# EAGLE schematic UNDP_Shield (EAGLE 9.6.2)
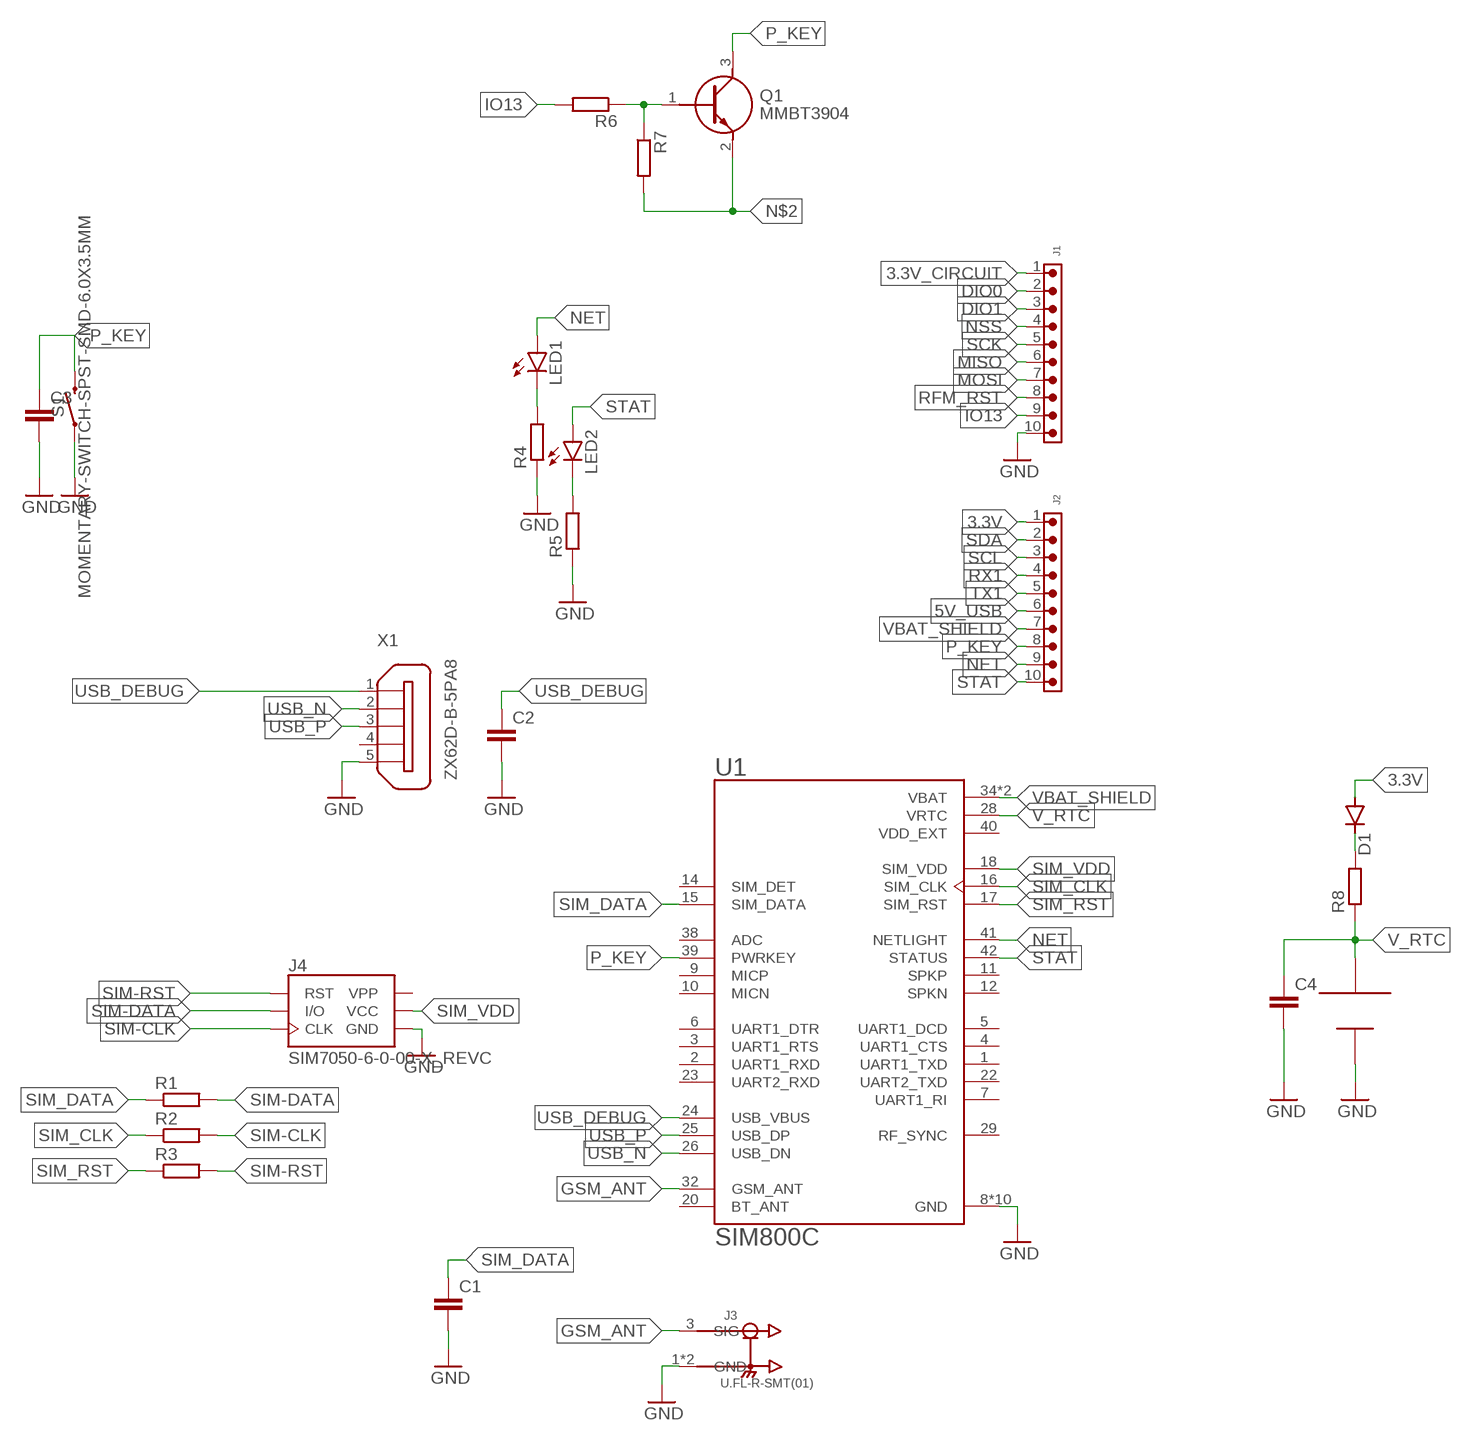
[diagram p0: schematic, sheet 1]

## Parts
C1  C-EUC0603  [C0603]
C2  C-EUC0603  [C0603]
C3  C-EUC0603  [C0603]
C4  C-EUC0603  [C0603]
D1  DIODE-DO214AC  [DO214AC]
J1  6200XX11121_62001011121  [62001011121]
J2  6200XX11121_62001011121  [62001011121]
J3  U.FL-R-SMT(01)  [HRS_U.FL-R-SMT(01)]
J4  SIM7050-6-0-00-X_REVC  [GCT_SIM7050-6-0-00-X_REVC]
LED1  LEDCHIP-LED0805  [CHIP-LED0805]
LED2  LEDCHIP-LED0805  [CHIP-LED0805]
Q1  MMBT3904  [SOT95P240X120-3N]
R1  R-EU_R0603  [R0603]
R2  R-EU_R0603  [R0603]
R3  R-EU_R0603  [R0603]
R4  R-EU_R0603  [R0603]
R5  R-EU_R0603  [R0603]
R6  R-EU_R0603  [R0603]
R7  R-EU_R0603  [R0603]
R8  R-EU_R0603  [R0603]
S1  MOMENTARY-SWITCH-SPST-SMD-6.0X3.5MM  [TACTILE_SWITCH_SMD_6.0X3.5MM]
U1  SIM800C  [LCC110P1570X1760X250-42N]
U$1  MS621FE  [MS621FE]
X1  ZX62D-B-5PA8  [ZX62D-B-5PA8]

## Nets
3.3V: D1.A J2.1
3.3V_CIRCUIT: J1.1
5V_USB: J2.6
DIO0: J1.2
DIO1: J1.3
GND: C1.2 C2.2 C3.2 C4.2 J1.10 J3.1(GND) J3.2(GND) J4.C5(GND) R4.1 R5.1 S1.1 U1.8(GND) U1.13(GND) U1.19(GND) U1.21(GND) U1.27(GND) U1.30(GND) U1.31(GND) U1.33(GND) U1.36(GND) U1.37(GND) U$1.V- X1.5
GSM_ANT: J3.3(SIG) U1.32(GSM_ANT)
IO13: J1.9 R6.2
MISO: J1.6
MOSI: J1.7
N$2: Q1.2(E) R7.2
N$3: Q1.1(B) R6.1 R7.1
N$4: LED2.C R5.2
N$5: LED1.C R4.2
N$6: D1.C R8.2
NET: J2.9 LED1.A U1.41(NETLIGHT)
NSS: J1.4
P_KEY: C3.1 J2.8 Q1.3(C) S1.2 U1.39(PWRKEY)
RFM_RST: J1.8
RX1: J2.4
SCK: J1.5
SCL: J2.3
SDA: J2.2
SIM-CLK: J4.C3(CLK) R2.2
SIM-DATA: J4.C7(I/O) R1.2
SIM-RST: J4.C2(RST) R3.2
SIM_CLK: R2.1 U1.16(SIM_CLK)
SIM_DATA: C1.1 R1.1 U1.15(SIM_DATA)
SIM_RST: R3.1 U1.17(SIM_RST)
SIM_VDD: J4.C1(VCC) U1.18(SIM_VDD)
STAT: J2.10 LED2.A U1.42(STATUS)
TX1: J2.5
USB_DEBUG: C2.1 U1.24(USB_VBUS) X1.1
USB_N: U1.26(USB_DN) X1.2
USB_P: U1.25(USB_DP) X1.3
V_RTC: C4.1 R8.1 U1.28(VRTC) U$1.V+
VBAT_SHIELD: J2.7 U1.34(VBAT) U1.35(VBAT)
Unconnected: U1.1(UART1_TXD) U1.2(UART1_RXD) U1.3(UART1_RTS) U1.4(UART1_CTS) U1.5(UART1_DCD) U1.6(UART1_DTR) U1.7(UART1_RI) U1.9(MICP) U1.10(MICN) U1.11(SPKP) U1.12(SPKN) U1.14(SIM_DET) U1.20(BT_ANT) U1.22(UART2_TXD) U1.23(UART2_RXD) U1.29(RF_SYNC) U1.38(ADC) X1.4 X1.S1 X1.S2 X1.S3 X1.S4

## Power pins joined to a net without a drawn wire
VDD_EXT: U1.40(VDD_EXT)
VPP: J4.C6(VPP)

## Library data of the parts
C1-C4 = rcl:C-EU: CAPACITOR, European symbol; SPICEPREFIX: C
D1 = diode:DIODE-: DIODE
J1 J2 = Wurth_Connectors_WR-PHD:6200XX11121_62001011121: WR-PHD 2.00 mm THT Pin Header ARTICLE PROPERTIES: Pins:2;​ 3;​ 4;​ 6;​ 8;​ 10;​ 20;​ 32 KIND PROPERTIES: Pitch：2 mm Quality Class:3 as per CECC 75 301-802 Rows：Single Gender：Pin Header Type：Straight MATERIAL PROPERTIES: Insulator Material :PA9T Insulator Flammability Rating:UL94 V-0 Contact Material:Copper Alloy Contact Plating:Gold Contact Type:Stamped GENERAL INFORMATION Operating Temperature:-40 up to +105 °C Compliance:Lead free / RoHS ELECTRICAL PROPERTIES: Rated Current:max.;​ 2 A IR 1:2A Withstanding Voltage:500 V (AC) Contact Resistance:20 mΩ RISO:1000 MΩ CERTIFICATION UL Approval:E323964 PACKAGING PROPERTIES Packaging:Bag Packaging Unit:1000;​ 500;​ 300;​ 200 <https://katalog.we-online.com/media/images/v2/o33219v209%20Family_WR-PHD_6200xx11121.jpg> Details see: https://katalog.we-online.com/en/em/PHD_2_00_THT_PIN_HEADER_6200XX11121 Updated by Yingchun,Shan 2019-10-24 2019 (C) Würth Elektronik; DATASHEET-URL: https://katalog.we-online.com/em/datasheet/62001011121.pdf; GENDER: Pin Header; IR: 2A; MATES: WR-PHD 2.0mm Socket Header; PACKAGING: Bag; PART-NUMBER: 62001011121; PINS: 10; ROWS: Single; TYPE: Straight
J3 = U.FL-R-SMT_01_:U.FL-R-SMT(01): U.FL Series 6 Ghz 50 Ohm Ultra-small SMT Coaxial Cable Receptacle Check prices <https://pricing.snapeda.com/parts/U.FL-R-SMT%2801%29/Hirose/view-part?ref=eda>; AVAILABILITY: In Stock; DESCRIPTION: U.FL (UMCC) Connector Receptacle, Male Pin 50Ohm Surface Mount Solder. RF Connectors / Coaxial Connectors; MF: Hirose; MP: U.FL-R-SMT(01); PACKAGE: None; PRICE: None; PURCHASE-URL: https://pricing.snapeda.com/search/part/U.FL-R-SMT(01)/?ref=eda
J4 = SIM7050-6-0-00-X_REVC:SIM7050-6-0-00-X_REVC: Micro SIM Card Connector, Retainer Type, 6 & 8 Pin, SMT, Profile 2.45mm Check prices <https://pricing.snapeda.com/parts/SIM7050-6-0-00-A/Global%20Connector%20Technology/view-part?ref=eda>; AVAILABILITY: Not in stock; DESCRIPTION: 6 Position Card Connector Micro SIM Surface Mount, Right Angle Gold, Without switch, 2.45mm profile, Push-Pull, 3FF Sim card type; MF: Global Connector Technology; MP: SIM7050-6-0-00-A; PACKAGE: None; PRICE: None
LED1 LED2 = led:LED: LED OSRAM: - CHIPLED LG R971, LG N971, LY N971, LG Q971, LY Q971, LO R971, LY R971 LH N974, LH R974 LS Q976, LO Q976, LY Q976 LO Q996 - Hyper CHIPLED LW Q18S LB Q993, LB Q99A, LB R99A - SideLED LS A670, LO A670, LY A670, LG A670, LP A670 LB A673, LV A673, LT A673, LW A673 LH A674 LY A675 LS A676, LA A676, LO A676, LY A676, LW A676 LS A679, LY A679, LG A679 - Hyper Micro SIDELED® LS Y876, LA Y876, LO Y876, LY Y876 LT Y87S - SmartLED LW L88C, LW L88S LB L89C, LB L89S, LG L890 LS L89K, LO L89K, LY L89K LS L896, LA L896, LO L896, LY L896 - TOPLED LS T670, LO T670, LY T670, LG T670, LP T670 LSG T670, LSP T670, LSY T670, LOP T670, LYG T670 LG T671, LOG T671, LSG T671 LB T673, LV T673, LT T673, LW T673 LH T674 LS T676, LA T676, LO T676, LY T676, LB T676, LH T676, LSB T676, LW T676 LB T67C, LV T67C, LT T67C, LS T67K, LO T67K, LY T67K, LW E67C LS E67B, LA E67B, LO E67B, LY E67B, LB E67C, LV E67C, LT E67C LW T67C LS T679, LY T679, LG T679 LS T770, LO T770, LY T770, LG T770, LP T770 LB T773, LV T773, LT T773, LW T773 LH T774 LS E675, LA E675, LY E675, LS T675 LS T776, LA T776, LO T776, LY T776, LB T776 LHGB T686 LT T68C, LB T68C - Hyper Mini TOPLED® LB M676 - Mini TOPLED Santana® LG M470 LS M47K, LO M47K, LY M47K Source: http://www.osram.convergy.de LUXEON: - LUMILED® LXK2-PW12-R00, LXK2-PW12-S00, LXK2-PW14-U00, LXK2-PW14-V00 LXK2-PM12-R00, LXK2-PM12-S00, LXK2-PM14-U00 LXK2-PE12-Q00, LXK2-PE12-R00, LXK2-PE12-S00, LXK2-PE14-T00, LXK2-PE14-U00 LXK2-PB12-K00, LXK2-PB12-L00, LXK2-PB12-M00, LXK2-PB14-N00, LXK2-PB14-P00, LXK2-PB14-Q00 LXK2-PR12-L00, LXK2-PR12-M00, LXK2-PR14-Q00, LXK2-PR14-R00 LXK2-PD12-Q00, LXK2-PD12-R00, LXK2-PD12-S00 LXK2-PH12-R00, LXK2-PH12-S00 LXK2-PL12-P00, LXK2-PL12-Q00, LXK2-PL12-R00 Source: www.luxeon.com KINGBRIGHT: KA-3528ASYC Source: www.kingbright.com
Q1 = MMBT3904:MMBT3904: Transistor GP BJT NPN 40V 0.2A SOT23 Fairchild MMBT3904 NPN Bipolar Transistor, 0.2 A, 40 V, 3-Pin SOT-23 Source: Datasheet <https://media.digikey.com/pdf/Data Sheets/ON Semiconductor PDFs/2N3904,MMBT3904,PZT3904.pdf>; ARROW_PART_NUMBER: MMBT3904; ARROW_PRICE-STOCK: https://www.arrow.com/en/products/mmbt3904/on-semiconductor; DESCRIPTION: Transistor GP BJT NPN 40V 0.2A SOT23 Fairchild MMBT3904 NPN Bipolar Transistor, 0.2 A, 40 V, 3-Pin SOT-23; HEIGHT: 1.2mm; MANUFACTURER_NAME: ON Semiconductor; MANUFACTURER_PART_NUMBER: MMBT3904; MOUSER_PART_NUMBER: 512-MMBT3904; MOUSER_PRICE-STOCK: https://www.mouser.co.uk/ProductDetail/ON-Semiconductor-Fairchild/MMBT3904?qs=UMEuL5FsraCg3xKjS4uBJQ%3D%3D
R1-R8 = rcl:R-EU_: RESISTOR, European symbol; SPICEPREFIX: R
S1 = SparkFun-Switches:MOMENTARY-SWITCH-SPST: Momentary Switch (Pushbutton) - SPST Normally-open (NO) SPST momentary switches (buttons, pushbuttons). Variants PTH-12MM - 12mm square, through-hole Momentary Pushbutton Switch - 12mm Square <https://www.sparkfun.com/products/9190> (COM-09190) PTH-6.0MM, PTH-6.0MM-KIT - 6.0mm square, through-hole Mini Pushbutton Switch <https://www.sparkfun.com/products/97> (COM-00097) KIT package intended for soldering kit's - only one side of pads' copper is exposed. PTH-RIGHT-ANGLE-KIT - Right-angle, through-hole Right Angle Tactile Button <https://www.sparkfun.com/products/10791> - Used on SparkFun BigTime Watch Kit <https://www.sparkfun.com/products/11734> SMD-12MM - 12mm square, surface-mount Tactile Button - SMD (12mm) <https://www.sparkfun.com/products/12993> (COM-12993) Used on SparkFun PicoBoard <https://www.sparkfun.com/products/11888> SMD-4.5MM - 4.5mm Square Trackball Switch Used on SparkFun Blackberry Trackballer Breakout <https://www.sparkfun.com/products/13169> SMD-4.6MMX2.8MM - 4.60mm x 2.80mm, surface mount Used on SparkFun SAMD21 Mini Breakout <https://www.sparkfun.com/products/13664> SMD-5.2MM, SMD-5.2-REDUNDANT - 5.2mm square, surface-mount Mini Pushbutton Switch - SMD <https://www.sparkfun.com/products/8720> (COM-08720) Used on Arduino Pro Mini <https://www.sparkfun.com/products/11114> REDUNDANT package connects both switch circuits together SMD-6.0X3.5MM - 6.0 x 3.5mm, surface mount Momentary Reset Switch SMD <https://www.sparkfun.com/products/8229> (COM-08229) SMD-6.2MM-TALL - 6.2mm square, surface mount Tactile Button - SMD (6mm) <https://www.sparkfun.com/products/12992> Used on SparkFun Digital Sandbox <https://www.sparkfun.com/products/12651> SMD-RIGHT-ANGLE - Right-angle, surface mount Used on SparkFun Block for Intel® Edison - Arduino <https://www.sparkfun.com/products/13036>; PROD_ID: SWCH-00815; SF_SKU: COM-08229
U1 = SIM800C:SIM800C: Module: GSM/Bluetooth; GPRS; 2G; 1800MHz, 900MHz; 85.6kbps; SMD Check prices <https://pricing.snapeda.com/parts/SIM800C/Simcom/view-part?ref=eda>; AVAILABILITY: In Stock; DESCRIPTION: Module: GSM/Bluetooth; GPRS; 2G; 1800MHz, 900MHz; 85.6kbps; SMD; MF: Simcom; MP: SIM800C; PACKAGE: None; PRICE: None
U$1 = MS621FE:MS621FE
X1 = microusb 5p:ZX62D-B-5PA8: Micro USB Type B Connector - Standard, Shell Through Hole Source: http://www.hirose.co.jp/cataloge_hp/ed_ZX_20140804.pdf; MF: Hirose; MPN: ZX62D-B-5PA8; OC_FARNELL: 2300438; OC_NEWARK: 69W0712